# Altium schematic sheet Sheet_1_2021-12-20.schdoc
size 49 x 27 mm
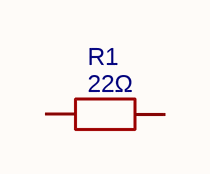
[diagram p0: Sheet_1_2021-12-20.schdoc]

## Parts
R1  22Ω  [R0805]

## Nets

Not connected (* = marked no-connect by the designer): R1 1 2

## Library data of the parts
R1 = 22Ω: BOM_Manufacturer: PANASONIC(松下); BOM_Manufacturer Part: ERJP06F22R0V; nameAlias: Resistance; Contributor: LCSC; BOM_Supplier: LCSC; BOM_Supplier Part: C441970; BOM_JLCPCB Part Class: Extended Part; spicePre: R; spiceSymbolName: ERJP06F22R0V